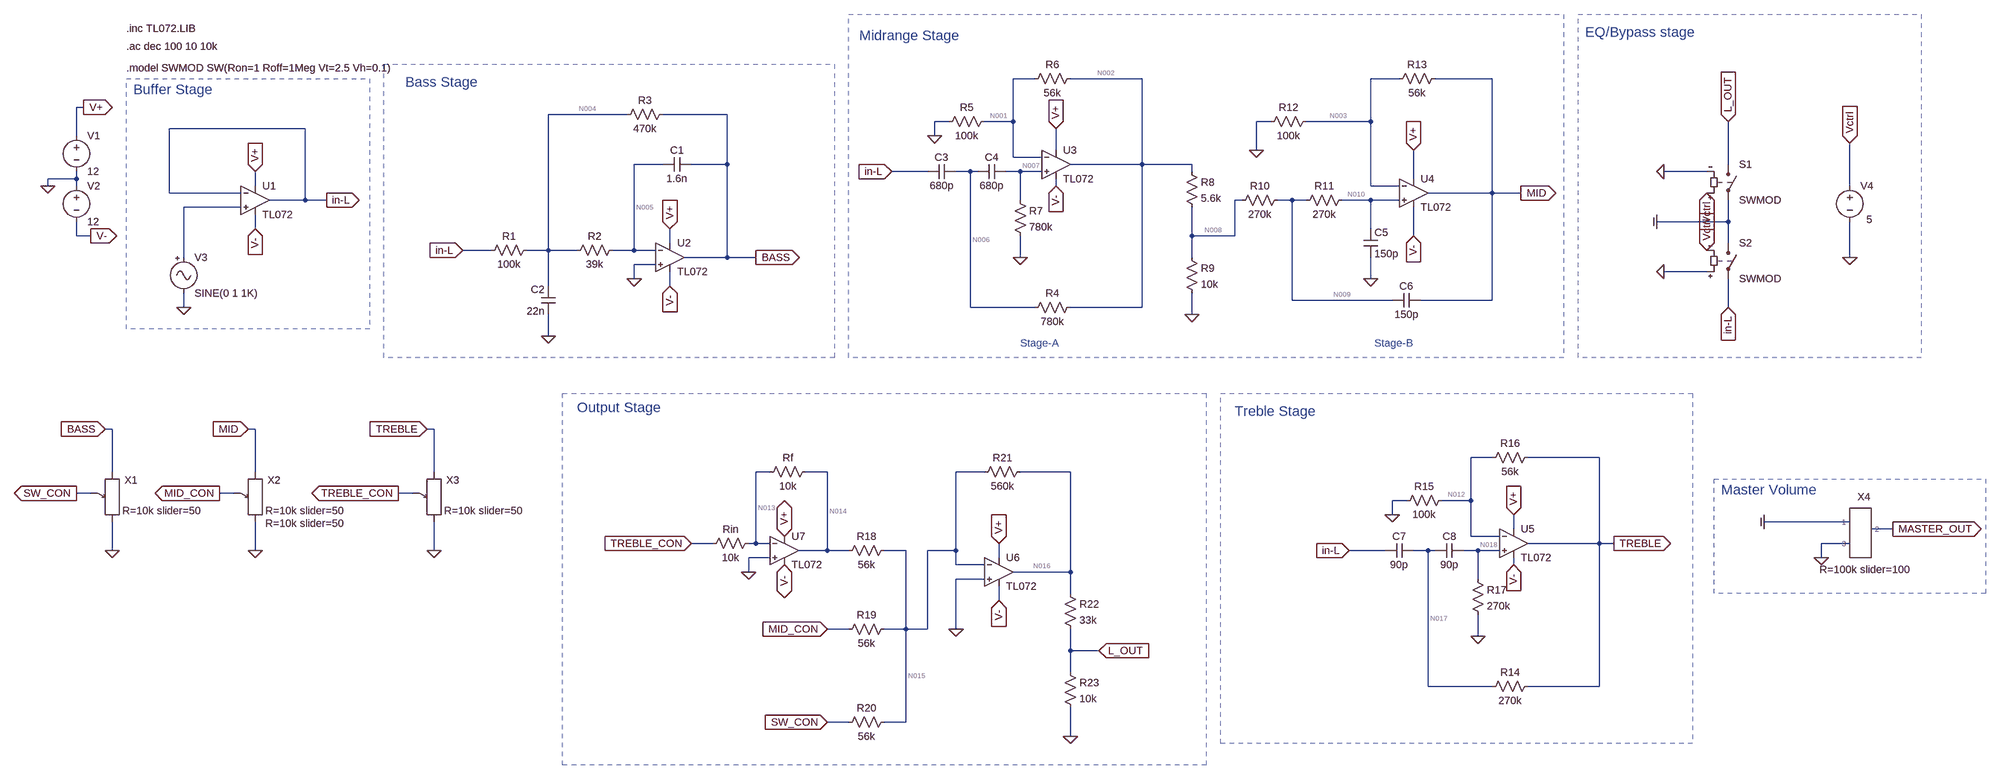
[diagram p0: schematic Audio-Preamplifier.asc]
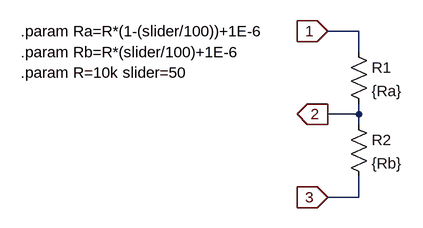
[diagram p1: sub-circuit potentiometer.asc]
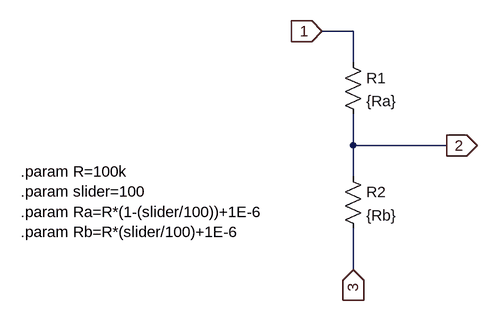
[diagram p2: sub-circuit master_volume.asc]
Audio-Preamplifier.asc, the LTspice schematic file:
Version 4.1
SHEET 1 4356 1524
WIRE 1600 -48 1552 -48
WIRE 1840 -48 1680 -48
WIRE 2416 -48 2352 -48
WIRE 2624 -48 2496 -48
WIRE -528 16 -544 16
WIRE 688 32 512 32
WIRE 912 32 768 32
WIRE 1408 48 1376 48
WIRE 1552 48 1552 -48
WIRE 1552 48 1488 48
WIRE 2128 48 2096 48
WIRE 2352 48 2352 -48
WIRE 2352 48 2208 48
WIRE -32 64 -336 64
WIRE -544 80 -544 16
WIRE 1376 80 1376 48
WIRE 1648 112 1648 64
WIRE 2096 112 2096 48
WIRE 1552 128 1552 48
WIRE 1616 128 1552 128
WIRE 768 144 704 144
WIRE 912 144 912 32
WIRE 912 144 832 144
WIRE 1840 144 1840 -48
WIRE 1840 144 1680 144
WIRE 1952 144 1840 144
WIRE 3152 144 3152 48
WIRE 1360 160 1280 160
WIRE 1456 160 1424 160
WIRE 1472 160 1456 160
WIRE 1568 160 1536 160
WIRE 1616 160 1568 160
WIRE 1952 160 1952 144
WIRE 3104 160 3008 160
WIRE -544 176 -544 160
WIRE -544 176 -608 176
WIRE 2448 176 2448 112
WIRE -608 192 -608 176
WIRE -544 192 -544 176
WIRE -144 192 -144 160
WIRE 1648 192 1648 176
WIRE 2352 192 2352 48
WIRE 2416 192 2352 192
WIRE 3424 192 3424 96
WIRE -336 208 -336 64
WIRE -176 208 -336 208
WIRE 2624 208 2624 -48
WIRE 2624 208 2480 208
WIRE 2688 208 2624 208
WIRE -32 224 -32 64
WIRE -32 224 -112 224
WIRE 16 224 -32 224
WIRE 1568 224 1568 160
WIRE 2064 224 2048 224
WIRE 2176 224 2144 224
WIRE 2208 224 2176 224
WIRE 2352 224 2288 224
WIRE 2416 224 2352 224
WIRE -176 240 -304 240
WIRE 3152 272 3152 224
WIRE 3152 272 2992 272
WIRE -144 288 -144 256
WIRE 2352 288 2352 224
WIRE -544 304 -544 272
WIRE -512 304 -544 304
WIRE 1952 304 1952 240
WIRE 2048 304 2048 224
WIRE 2048 304 1952 304
WIRE 2448 304 2448 240
WIRE 784 320 784 288
WIRE 3152 320 3152 272
WIRE 384 336 320 336
WIRE 512 336 512 32
WIRE 512 336 464 336
WIRE 576 336 512 336
WIRE 704 336 704 144
WIRE 704 336 656 336
WIRE 752 336 704 336
WIRE -304 352 -304 240
WIRE 912 352 912 144
WIRE 912 352 816 352
WIRE 976 352 912 352
WIRE 1568 352 1568 304
WIRE 1952 352 1952 304
WIRE 3424 352 3424 272
WIRE 752 368 704 368
WIRE 3104 384 3008 384
WIRE 704 400 704 368
WIRE 2352 400 2352 352
WIRE 512 416 512 336
WIRE 784 416 784 384
WIRE 2176 448 2176 224
WIRE 2400 448 2176 448
WIRE 2624 448 2624 208
WIRE 2624 448 2464 448
WIRE -304 464 -304 432
WIRE 1456 464 1456 160
WIRE 1600 464 1456 464
WIRE 1840 464 1840 144
WIRE 1840 464 1680 464
WIRE 3152 464 3152 400
WIRE 1952 480 1952 432
WIRE 512 528 512 480
WIRE -464 736 -480 736
WIRE -144 736 -160 736
WIRE 256 736 240 736
WIRE 2624 800 2576 800
WIRE 2864 800 2704 800
WIRE -464 832 -464 736
WIRE -144 832 -144 736
WIRE 256 832 256 736
WIRE 1008 832 976 832
WIRE 1136 832 1088 832
WIRE 1488 832 1424 832
WIRE 1680 832 1568 832
WIRE -512 880 -544 880
WIRE -192 880 -224 880
WIRE 208 880 176 880
WIRE 2432 896 2400 896
WIRE 2576 896 2576 800
WIRE 2576 896 2512 896
WIRE 2400 928 2400 896
WIRE 3424 944 3232 944
WIRE 2672 960 2672 928
WIRE 3520 960 3472 960
WIRE 2576 976 2576 896
WIRE 2640 976 2576 976
WIRE 880 992 832 992
WIRE 976 992 976 832
WIRE 976 992 960 992
WIRE 1008 992 976 992
WIRE 2864 992 2864 800
WIRE 2864 992 2704 992
WIRE 2896 992 2864 992
WIRE 3424 992 3360 992
WIRE -464 1008 -464 944
WIRE -144 1008 -144 944
WIRE 256 1008 256 944
WIRE 1136 1008 1136 832
WIRE 1136 1008 1072 1008
WIRE 1184 1008 1136 1008
WIRE 1312 1008 1264 1008
WIRE 1424 1008 1424 832
WIRE 1424 1008 1360 1008
WIRE 2384 1008 2304 1008
WIRE 2480 1008 2448 1008
WIRE 2496 1008 2480 1008
WIRE 2592 1008 2560 1008
WIRE 2640 1008 2592 1008
WIRE 1008 1024 960 1024
WIRE 1520 1024 1520 992
WIRE 3360 1024 3360 992
WIRE 1424 1040 1424 1008
WIRE 1488 1040 1424 1040
WIRE 2672 1040 2672 1024
WIRE 960 1056 960 1024
WIRE 1680 1056 1680 832
WIRE 1680 1056 1552 1056
WIRE 1488 1072 1424 1072
WIRE 2592 1072 2592 1008
WIRE 1680 1104 1680 1056
WIRE 1520 1120 1520 1088
WIRE 1184 1184 1136 1184
WIRE 1312 1184 1312 1008
WIRE 1312 1184 1264 1184
WIRE 1360 1184 1360 1008
WIRE 1360 1184 1312 1184
WIRE 1424 1184 1424 1072
WIRE 2592 1200 2592 1152
WIRE 1680 1232 1680 1184
WIRE 1744 1232 1680 1232
WIRE 1680 1280 1680 1232
WIRE 2480 1312 2480 1008
WIRE 2624 1312 2480 1312
WIRE 2864 1312 2864 992
WIRE 2864 1312 2704 1312
WIRE 1184 1392 1136 1392
WIRE 1312 1392 1312 1184
WIRE 1312 1392 1264 1392
WIRE 1680 1424 1680 1360
FLAG -608 192 0
FLAG -528 16 V+
IOPIN -528 16 Out
FLAG -512 304 V-
IOPIN -512 304 Out
FLAG -304 464 0
FLAG 16 224 in-L
IOPIN 16 224 Out
FLAG 704 400 0
FLAG 320 336 in-L
IOPIN 320 336 In
FLAG 2448 112 V+
IOPIN 2448 112 In
FLAG 2448 304 V-
IOPIN 2448 304 In
FLAG 1648 192 V-
IOPIN 1648 192 In
FLAG 1376 80 0
FLAG 1568 352 0
FLAG 1952 480 0
FLAG 2352 400 0
FLAG 2096 112 0
FLAG 976 352 BASS
IOPIN 976 352 Out
FLAG 2688 208 MID
IOPIN 2688 208 Out
FLAG 2672 1040 V-
IOPIN 2672 1040 In
FLAG 2400 928 0
FLAG 2592 1200 0
FLAG 2896 992 TREBLE
IOPIN 2896 992 Out
FLAG 1648 64 V+
IOPIN 1648 64 In
FLAG 784 288 V+
IOPIN 784 288 In
FLAG -144 160 V+
IOPIN -144 160 In
FLAG 784 416 V-
IOPIN 784 416 In
FLAG -144 288 V-
IOPIN -144 288 In
FLAG 2672 928 V+
IOPIN 2672 928 In
FLAG 1520 992 V+
IOPIN 1520 992 In
FLAG 1520 1120 V-
IOPIN 1520 1120 In
FLAG -480 736 BASS
IOPIN -480 736 In
FLAG -160 736 MID
IOPIN -160 736 In
FLAG 240 736 TREBLE
IOPIN 240 736 In
FLAG -464 1008 0
FLAG -144 1008 0
FLAG 256 1008 0
FLAG -544 880 SW_CON
IOPIN -544 880 Out
FLAG -224 880 MID_CON
IOPIN -224 880 Out
FLAG 176 880 TREBLE_CON
IOPIN 176 880 Out
FLAG 1136 1184 MID_CON
IOPIN 1136 1184 In
FLAG 1744 1232 L_OUT
IOPIN 1744 1232 In
FLAG 512 528 0
FLAG 1280 160 in-L
IOPIN 1280 160 In
FLAG 2304 1008 in-L
IOPIN 2304 1008 In
FLAG 1424 1184 0
FLAG 1136 1392 SW_CON
IOPIN 1136 1392 In
FLAG 960 1056 0
FLAG 832 992 TREBLE_CON
IOPIN 832 992 In
FLAG 1040 976 V+
IOPIN 1040 976 BiDir
FLAG 1040 1040 V-
IOPIN 1040 1040 BiDir
FLAG 3360 1024 0
FLAG 3520 960 MASTER_OUT
IOPIN 3520 960 Out
FLAG 3232 944 COM
IOPIN 3232 944 In
FLAG 3152 48 L_OUT
IOPIN 3152 48 In
FLAG 2992 272 COM
IOPIN 2992 272 In
FLAG 3152 464 in-L
IOPIN 3152 464 In
FLAG 3424 352 0
FLAG 3424 96 Vctrl
IOPIN 3424 96 In
FLAG 3104 208 Vctrl
IOPIN 3104 208 In
FLAG 3104 336 Vctrl
IOPIN 3104 336 In
FLAG 3008 160 0
FLAG 3008 384 0
FLAG 1680 1424 0
SYMBOL OpAmps\\opamp2 -144 160 R0
SYMATTR InstName U1
SYMATTR Value TL072
SYMBOL voltage -544 64 R0
WINDOW 123 0 0 Left 0
WINDOW 39 0 0 Left 0
SYMATTR InstName V1
SYMATTR Value 12
SYMBOL voltage -544 176 R0
WINDOW 123 0 0 Left 0
WINDOW 39 0 0 Left 0
SYMATTR InstName V2
SYMATTR Value 12
SYMBOL Misc\\signal -304 336 R0
WINDOW 39 0 0 Left 0
SYMATTR InstName V3
SYMATTR Value2 AC 1 0
SYMBOL OpAmps\\opamp2 784 288 R0
SYMATTR InstName U2
SYMATTR Value TL072
SYMBOL res 480 320 R90
WINDOW 0 0 56 VBottom 2
WINDOW 3 32 56 VTop 2
SYMATTR InstName R1
SYMATTR Value 100k
SYMBOL res 672 320 R90
WINDOW 0 0 56 VBottom 2
WINDOW 3 32 56 VTop 2
SYMATTR InstName R2
SYMATTR Value 39k
SYMBOL res 784 16 R90
WINDOW 0 0 56 VBottom 2
WINDOW 3 32 56 VTop 2
SYMATTR InstName R3
SYMATTR Value 470k
SYMBOL cap 832 128 R90
WINDOW 0 0 32 VBottom 2
WINDOW 3 32 32 VTop 2
SYMATTR InstName C1
SYMATTR Value 1.6n
SYMBOL OpAmps\\opamp2 1648 80 R0
SYMATTR InstName U3
SYMATTR Value TL072
SYMBOL OpAmps\\opamp2 2448 144 R0
SYMATTR InstName U4
SYMATTR Value TL072
SYMBOL cap 1424 144 R90
WINDOW 0 0 32 VBottom 2
WINDOW 3 32 32 VTop 2
SYMATTR InstName C3
SYMATTR Value 680p
SYMBOL cap 1536 144 R90
WINDOW 0 0 32 VBottom 2
WINDOW 3 32 32 VTop 2
SYMATTR InstName C4
SYMATTR Value 680p
SYMBOL res 1696 448 R90
WINDOW 0 0 56 VBottom 2
WINDOW 3 32 56 VTop 2
SYMATTR InstName R4
SYMATTR Value 780k
SYMBOL res 1504 32 R90
WINDOW 0 0 56 VBottom 2
WINDOW 3 32 56 VTop 2
SYMATTR InstName R5
SYMATTR Value 100k
SYMBOL res 1696 -64 R90
WINDOW 0 0 56 VBottom 2
WINDOW 3 32 56 VTop 2
SYMATTR InstName R6
SYMATTR Value 56k
SYMBOL res 1552 208 R0
SYMATTR InstName R7
SYMATTR Value 780k
SYMBOL res 1936 144 R0
SYMATTR InstName R8
SYMATTR Value 5.6k
SYMBOL res 1936 336 R0
SYMATTR InstName R9
SYMATTR Value 10k
SYMBOL res 2304 208 R90
WINDOW 0 0 56 VBottom 2
WINDOW 3 32 56 VTop 2
SYMATTR InstName R11
SYMATTR Value 270k
SYMBOL res 2160 208 R90
WINDOW 0 0 56 VBottom 2
WINDOW 3 32 56 VTop 2
SYMATTR InstName R10
SYMATTR Value 270k
SYMBOL res 2224 32 R90
WINDOW 0 0 56 VBottom 2
WINDOW 3 32 56 VTop 2
SYMATTR InstName R12
SYMATTR Value 100k
SYMBOL res 2512 -64 R90
WINDOW 0 0 56 VBottom 2
WINDOW 3 32 56 VTop 2
SYMATTR InstName R13
SYMATTR Value 56k
SYMBOL cap 2336 288 R0
SYMATTR InstName C5
SYMATTR Value 150p
SYMBOL cap 2464 432 R90
WINDOW 0 0 32 VBottom 2
WINDOW 3 32 32 VTop 2
SYMATTR InstName C6
SYMATTR Value 150p
SYMBOL OpAmps\\opamp2 2672 928 R0
SYMATTR InstName U5
SYMATTR Value TL072
SYMBOL cap 2448 992 R90
WINDOW 0 0 32 VBottom 2
WINDOW 3 32 32 VTop 2
SYMATTR InstName C7
SYMATTR Value 90p
SYMBOL cap 2560 992 R90
WINDOW 0 0 32 VBottom 2
WINDOW 3 32 32 VTop 2
SYMATTR InstName C8
SYMATTR Value 90p
SYMBOL res 2720 1296 R90
WINDOW 0 0 56 VBottom 2
WINDOW 3 32 56 VTop 2
SYMATTR InstName R14
SYMATTR Value 270k
SYMBOL res 2528 880 R90
WINDOW 0 0 56 VBottom 2
WINDOW 3 32 56 VTop 2
SYMATTR InstName R15
SYMATTR Value 100k
SYMBOL res 2720 784 R90
WINDOW 0 0 56 VBottom 2
WINDOW 3 32 56 VTop 2
SYMATTR InstName R16
SYMATTR Value 56k
SYMBOL res 2576 1056 R0
SYMATTR InstName R17
SYMATTR Value 270k
SYMBOL OpAmps\\opamp2 1520 992 R0
SYMATTR InstName U6
SYMATTR Value TL072
SYMBOL res 1584 816 R90
WINDOW 0 0 56 VBottom 2
WINDOW 3 32 56 VTop 2
SYMATTR InstName R21
SYMATTR Value 560k
SYMBOL res 1280 1168 R90
WINDOW 0 0 56 VBottom 2
WINDOW 3 32 56 VTop 2
SYMATTR InstName R19
SYMATTR Value 56k
SYMBOL res 1280 992 R90
WINDOW 0 0 56 VBottom 2
WINDOW 3 32 56 VTop 2
SYMATTR InstName R18
SYMATTR Value 56k
SYMBOL potentiometer -464 864 R0
SYMATTR InstName X1
SYMATTR Value R=10k slider=50
SYMBOL potentiometer -144 864 R0
WINDOW 39 23 83 Left 2
SYMATTR SpiceLine R=10k slider=50
SYMATTR InstName X2
SYMATTR Value R=10k slider=50
SYMBOL potentiometer 256 864 R0
SYMATTR InstName X3
SYMATTR Value R=10k slider=50
SYMBOL res 1664 1088 R0
SYMATTR InstName R22
SYMATTR Value 33k
SYMBOL res 1664 1264 R0
SYMATTR InstName R23
SYMATTR Value 10k
SYMBOL cap 528 480 R180
WINDOW 0 24 56 Left 2
WINDOW 3 24 8 Left 2
SYMATTR InstName C2
SYMATTR Value 22n
SYMBOL res 1280 1376 R90
WINDOW 0 0 56 VBottom 2
WINDOW 3 32 56 VTop 2
SYMATTR InstName R20
SYMATTR Value 56k
SYMBOL OpAmps\\opamp2 1040 944 R0
SYMATTR InstName U7
SYMATTR Value TL072
SYMBOL res 976 976 R90
WINDOW 0 0 56 VBottom 2
WINDOW 3 32 56 VTop 2
SYMATTR InstName Rin
SYMATTR Value 10k
SYMBOL res 1104 816 R90
WINDOW 0 0 56 VBottom 2
WINDOW 3 32 56 VTop 2
SYMATTR InstName Rf
SYMATTR Value 10k
SYMBOL master_volume 3456 944 R0
WINDOW 39 2 122 Bottom 2
SYMATTR SpiceLine R=100k slider=100
SYMATTR InstName X4
SYMBOL sw 3152 128 R0
SYMATTR InstName S1
SYMATTR Value SWMOD
SYMBOL sw 3152 304 R0
SYMATTR InstName S2
SYMATTR Value SWMOD
SYMBOL voltage 3424 176 R0
WINDOW 3 37 91 Left 2
WINDOW 123 0 0 Left 0
WINDOW 39 0 0 Left 0
SYMATTR Value 5
SYMATTR InstName V4
TEXT -432 -160 Left 2 !.inc TL072.LIB
TEXT -432 -120 Left 2 !.ac dec 100 10 10k
TEXT 1568 544 Left 2 ;Stage-A
TEXT 2360 544 Left 2 ;Stage-B
TEXT -432 -72 Left 2 !.model SWMOD SW(Ron=1 Roff=1Meg Vt=2.5 Vh=0.1)
TEXT -416 -24 Left 3 ;Buffer Stage
TEXT 192 -40 Left 3 ;Bass Stage
TEXT 1208 -144 Left 3 ;Midrange Stage
TEXT 2048 696 Left 3 ;Treble Stage
TEXT 576 688 Left 3 ;Output Stage
TEXT 2832 -152 Left 3 ;EQ/Bypass stage
TEXT 3136 872 Left 3 ;Master Volume
RECTANGLE Normal 112 512 -432 -48 2
RECTANGLE Normal 224 -48 224 -48 2
RECTANGLE Normal 1152 576 144 -80 2
RECTANGLE Normal 2784 576 1184 -192 2
RECTANGLE Normal 3072 1440 2016 656 2
RECTANGLE Normal 1984 1488 544 656 2
RECTANGLE Normal 3728 1104 3120 848 2
RECTANGLE Normal 3584 576 2816 -192 2

potentiometer.asc, the sub-circuit schematic file:
Version 4.1
SHEET 1 880 680
WIRE 128 32 80 32
WIRE 128 64 128 32
WIRE 128 160 128 144
WIRE 128 160 80 160
WIRE 128 176 128 160
WIRE 128 288 128 256
WIRE 128 288 80 288
FLAG 80 32 1
IOPIN 80 32 In
FLAG 80 160 2
IOPIN 80 160 Out
FLAG 80 288 3
IOPIN 80 288 In
SYMBOL res 112 48 R0
SYMATTR InstName R1
SYMATTR Value {Ra}
SYMBOL res 112 160 R0
SYMATTR InstName R2
SYMATTR Value {Rb}
TEXT -392 32 Left 2 !.param Ra=R*(1-(slider/100))+1E-6
TEXT -392 64 Left 2 !.param Rb=R*(slider/100)+1E-6
TEXT -392 96 Left 2 !.param R=10k slider=50

master_volume.asc, the sub-circuit schematic file:
Version 4.1
SHEET 1 880 680
WIRE 176 16 128 16
WIRE 176 64 176 16
WIRE 176 192 176 144
WIRE 320 192 176 192
WIRE 176 240 176 192
WIRE 176 384 176 320
FLAG 128 16 1
IOPIN 128 16 In
FLAG 320 192 2
IOPIN 320 192 Out
FLAG 176 384 3
IOPIN 176 384 In
SYMBOL res 160 48 R0
SYMATTR InstName R1
SYMATTR Value {Ra}
SYMBOL res 160 224 R0
SYMATTR InstName R2
SYMATTR Value {Rb}
TEXT -336 232 Left 2 !.param R=100k\n.param slider=100\n.param Ra=R*(1-(slider/100))+1E-6\n.param Rb=R*(slider/100)+1E-6

The netlist it stands for:
* Audio-Preamplifier.asc
X§U1 N011 in-L V+ V- in-L TL072  ; pins In+ In- V+ V- OUT
V1 V+ 0 12
V2 0 V- 12
V3 N011 0 SINE(0 1 1K) AC 1 0
X§U2 0 N005 V+ V- BASS TL072  ; pins In+ In- V+ V- OUT
R1 N004 in-L 100k
R2 N005 N004 39k
R3 BASS N004 470k
C1 BASS N005 1.6n
X§U3 N007 N001 V+ V- N002 TL072  ; pins In+ In- V+ V- OUT
X§U4 N010 N003 V+ V- MID TL072  ; pins In+ In- V+ V- OUT
C3 N006 in-L 680p
C4 N007 N006 680p
R4 N002 N006 780k
R5 N001 0 100k
R6 N002 N001 56k
R7 N007 0 780k
R8 N002 N008 5.6k
R9 N008 0 10k
R11 N010 N009 270k
R10 N009 N008 270k
R12 N003 0 100k
R13 MID N003 56k
C5 N010 0 150p
C6 MID N009 150p
X§U5 N018 N012 V+ V- TREBLE TL072  ; pins In+ In- V+ V- OUT
C7 N017 in-L 90p
C8 N018 N017 90p
R14 TREBLE N017 270k
R15 N012 0 100k
R16 TREBLE N012 56k
R17 N018 0 270k
X§U6 0 N015 V+ V- N016 TL072  ; pins In+ In- V+ V- OUT
R21 N016 N015 560k
R19 N015 MID_CON 56k
R18 N015 N014 56k
X§X1 BASS SW_CON 0 potentiometer params: R=10k slider=50
X§X2 MID MID_CON 0 potentiometer params: R=10k slider=50 R=10k slider=50
X§X3 TREBLE TREBLE_CON 0 potentiometer params: R=10k slider=50
R22 N016 L_OUT 33k
R23 L_OUT 0 10k
C2 0 N004 22n
R20 N015 SW_CON 56k
X§U7 0 N013 V+ V- N014 TL072  ; pins In+ In- V+ V- OUT
Rin N013 TREBLE_CON 10k
Rf N014 N013 10k
X§X4 COM 0 MASTER_OUT master_volume params: R=100k slider=100
S1 L_OUT COM Vctrl 0 SWMOD
S2 COM in-L 0 Vctrl SWMOD
V4 Vctrl 0 5

* block symbol definitions
.subckt potentiometer 1 2 3
R1 1 2 {Ra}
R2 2 3 {Rb}
.param Ra=R*(1-(slider/100))+1E-6
.param Rb=R*(slider/100)+1E-6
.param R=10k slider=50
.ends potentiometer

.subckt master_volume 1 3 2
R1 1 2 {Ra}
R2 2 3 {Rb}
.param R=100k
.param slider=100
.param Ra=R*(1-(slider/100))+1E-6
.param Rb=R*(slider/100)+1E-6
.ends master_volume

.inc TL072.LIB
.ac dec 100 10 10k
* Stage-A
* Stage-B
.model SWMOD SW(Ron=1 Roff=1Meg Vt=2.5 Vh=0.1)
* Buffer Stage
* Bass Stage
* Midrange Stage
* Treble Stage
* Output Stage
* EQ/Bypass stage
* Master Volume
.backanno
.end

* Results of the author's LTspice run, read from the files saved beside the schematic
* Operating Point, zero values left out:
*   V(bass) = 40.08 µV
*   V(com) = 42.31 µV
*   V(in-l) = 10.97 µV
*   V(l_out) = 42.31 µV
*   V(master_out) = 42.31 µV
*   V(mid) = -47.89 µV
*   V(mid_con) = -22.45 µV
*   V(n001) = -21.83 µV
*   V(n002) = -31.7 µV
*   V(n003) = -32.21 µV
*   V(n004) = 12.61 µV
*   V(n005) = 10.97 µV
*   V(n006) = -31.7 µV
*   V(n007) = -32.8 µV
*   V(n008) = -20.47 µV
*   V(n009) = -31.83 µV
*   V(n010) = -43.18 µV
*   V(n012) = -383.3 nV
*   V(n013) = 10.97 µV
*   V(n014) = 19.46 µV
*   V(n015) = 10.97 µV
*   V(n016) = 197 µV
*   V(n017) = 1.757 µV
*   V(n018) = -11.35 µV
*   V(sw_con) = 19.65 µV
*   V(treble) = 1.757 µV
*   V(treble_con) = 2.897 µV
*   V(v+) = 12 V
*   V(v-) = -12 V
*   V(vctrl) = 5 V
*   I(R1) = 16.4 pA
*   I(R10) = -42.05 pA
*   I(R11) = -42.05 pA
*   I(R12) = -322.1 pA
*   I(R13) = -280 pA
*   I(R15) = -3.833 pA
*   I(R16) = 38.22 pA
*   I(R17) = -42.05 pA
*   I(R18) = -151.7 pA
*   I(R19) = 596.8 pA
*   I(R2) = -42.05 pA
*   I(R20) = -155.1 pA
*   I(R21) = 332.1 pA
*   I(R22) = 4.686 nA
*   I(R23) = 4.231 nA
*   I(R3) = 58.45 pA
*   I(R5) = -218.3 pA
*   I(R6) = -176.2 pA
*   I(R7) = -42.05 pA
*   I(R8) = -2.005 nA
*   I(R9) = -2.047 nA
*   I(Rf) = 849.4 pA
*   I(Rin) = 807.4 pA
*   I(S1) = -454.5 pA
*   I(S2) = -31.34 pA
*   I(V1) = -79.76 mA
*   I(V2) = -79.76 mA
*   I(V3) = -42.05 pA
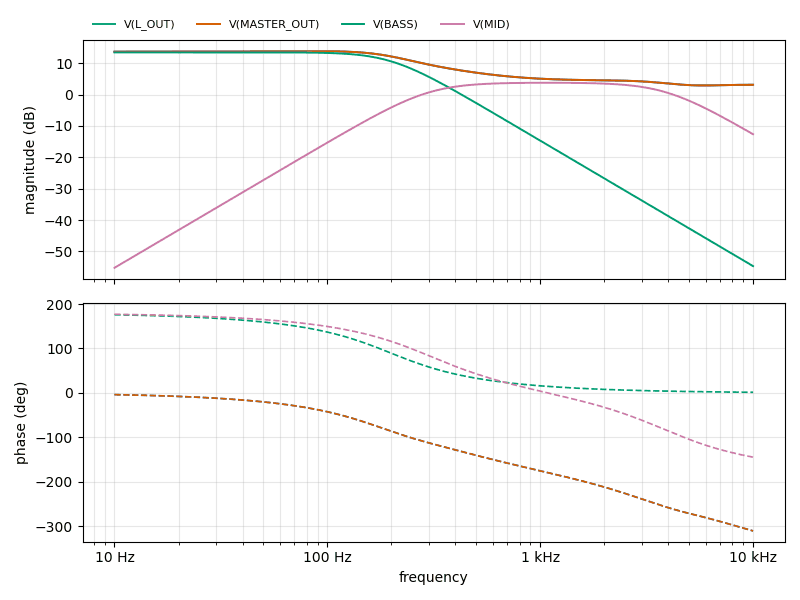
[diagram p3: AC Analysis of Audio-Preamplifier.asc, plotted from the saved traces]
* AC Analysis, 1 run:
*   V(L_OUT): 13.68 dB at 10 Hz, 3.12 dB at 10 kHz, peak 13.83 dB at 85.11 Hz, 3 dB below the peak at 246.7 Hz
*   V(MASTER_OUT): 13.68 dB at 10 Hz, 3.12 dB at 10 kHz, peak 13.83 dB at 85.11 Hz, 3 dB below the peak at 246.7 Hz
*   V(BASS): 13.44 dB at 10 Hz, -54.69 dB at 10 kHz, peak 13.45 dB at 43.65 Hz, 3 dB below the peak at 202.8 Hz
*   V(MID): -55.23 dB at 10 Hz, -12.64 dB at 10 kHz, peak 3.77 dB at 1.096 kHz, 3 dB below the peak at 302.3 Hz and 3.885 kHz